# Altium schematic sheet DGUS&串口打印机.SchDoc
size 76 x 127 mm
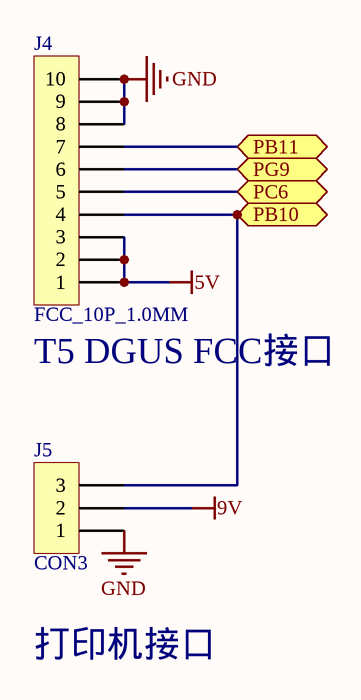
[diagram p0: DGUS&串口打印机.SchDoc]

## Parts
J4  FCC_10P_1.0MM  [FCC_10P]
J5  CON3  [XH2.54-3P]

## Ports
PB10, PB11, PC6, PG9

## Nets
5V: J4.1 J4.2 J4.3
9V: J5.2
GND: J4.8 J4.9 J4.10 J5.1
PB10: J4.4 J5.3 ; port PB10
PB11: J4.7 ; port PB11
PC6: J4.5 ; port PC6
PG9: J4.6 ; port PG9

## Notes on the sheet
- (near J4) T5 DGUS FCC接口
- 打印机接口

## Library data of the parts
J4 = CON10: 连接器
J5 = CON3: 连接器